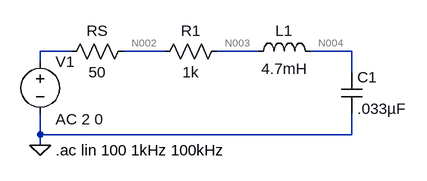
[diagram p0: schematic RLC_Series_Circuit.asc]
RLC_Series_Circuit.asc, the LTspice schematic file:
Version 4
SHEET 1 880 680
WIRE 0 112 -48 112
WIRE 144 112 80 112
WIRE 288 112 224 112
WIRE 432 112 368 112
WIRE -48 128 -48 112
WIRE 432 144 432 112
WIRE -48 240 -48 208
WIRE 432 240 432 208
WIRE 432 240 -48 240
WIRE -48 256 -48 240
FLAG -48 256 0
SYMBOL voltage -48 112 R0
WINDOW 123 24 104 Left 2
WINDOW 39 0 0 Left 0
SYMATTR InstName V1
SYMATTR Value ""
SYMATTR Value2 AC 2 0
SYMBOL res -16 128 R270
WINDOW 0 32 56 VTop 2
WINDOW 3 0 56 VBottom 2
SYMATTR InstName RS
SYMATTR Value 50
SYMBOL res 128 128 R270
WINDOW 0 32 56 VTop 2
WINDOW 3 0 56 VBottom 2
SYMATTR InstName R1
SYMATTR Value 1k
SYMBOL ind 272 128 R270
WINDOW 0 32 56 VTop 2
WINDOW 3 5 56 VBottom 2
SYMATTR InstName L1
SYMATTR Value 4.7mH
SYMBOL cap 416 144 R0
SYMATTR InstName C1
SYMATTR Value .033µF
TEXT -24 264 Left 2 !.ac lin 100 1kHz 100kHz

The netlist it stands for:
* RLC_Series_Circuit.asc
V1 N001 0 AC 2 0
RS N001 N002 50
R1 N002 N003 1k
L1 N003 N004 4.7mH
C1 N004 0 .033µF
.ac lin 100 1kHz 100kHz
.backanno
.end

* Results of the author's LTspice run, read from the files saved beside the schematic
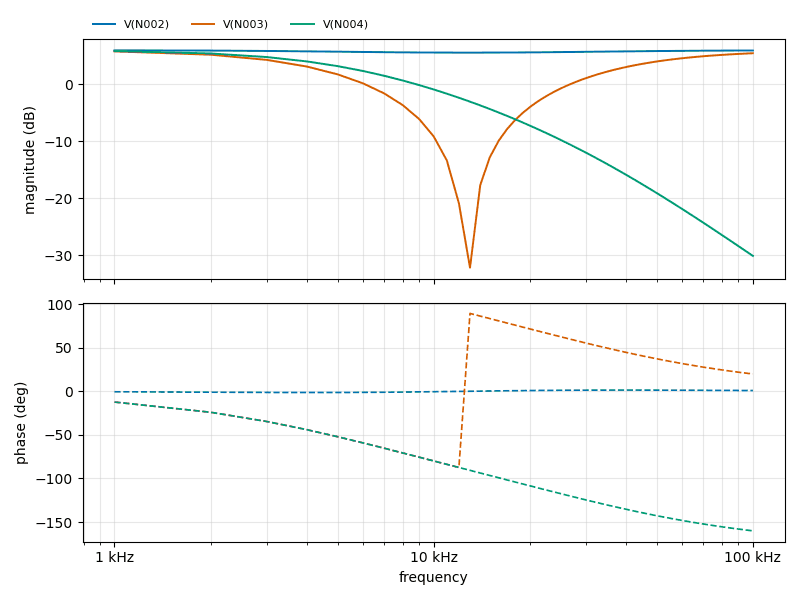
[diagram p1: AC Analysis of RLC_Series_Circuit.asc, plotted from the saved traces]
* AC Analysis, 1 run:
*   V(N002): 6.00 dB at 1 kHz, 5.97 dB at 100 kHz, peak 6.00 dB at 1 kHz
*   V(N003): 5.82 dB at 1 kHz, 5.49 dB at 100 kHz, peak 5.82 dB at 1 kHz, 3 dB below the peak at 4.236 kHz
*   V(N004): 5.87 dB at 1 kHz, -30.11 dB at 100 kHz, peak 5.87 dB at 1 kHz, 3 dB below the peak at 5.41 kHz